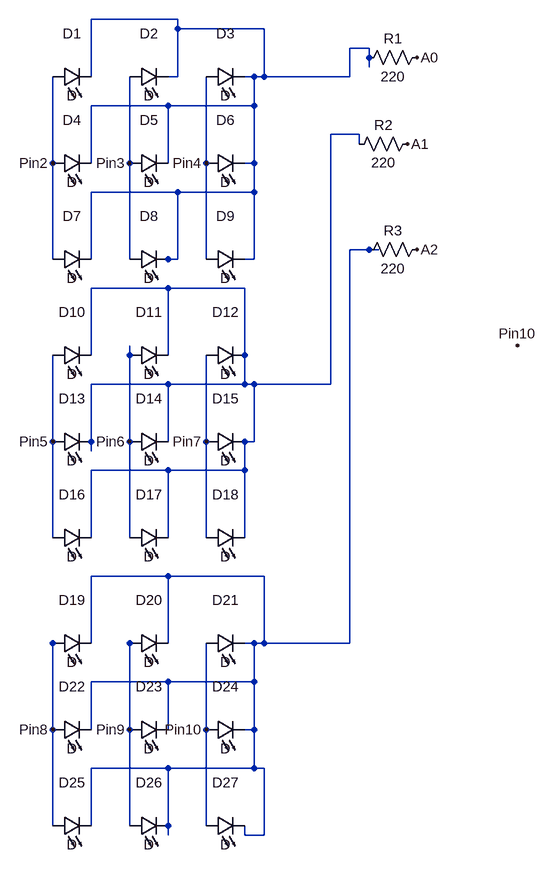
[diagram p0: schematic LightCube.asc]
LightCube.asc, the LTspice schematic file:
Version 4
SHEET 1 880 1344
WIRE -3408 -544 -3552 -544
WIRE -3408 -528 -3408 -544
WIRE -3264 -528 -3408 -528
WIRE -2864 -496 -2896 -496
WIRE -2864 -480 -2864 -496
WIRE -2864 -464 -2864 -480
WIRE -3552 -448 -3552 -544
WIRE -3408 -448 -3408 -528
WIRE -3408 -448 -3424 -448
WIRE -3280 -448 -3296 -448
WIRE -3264 -448 -3264 -528
WIRE -3264 -448 -3280 -448
WIRE -2896 -448 -2896 -496
WIRE -2896 -448 -3264 -448
WIRE -3424 -400 -3552 -400
WIRE -3280 -400 -3280 -448
WIRE -3280 -400 -3424 -400
WIRE -2880 -352 -2928 -352
WIRE -2880 -336 -2880 -352
WIRE -3616 -304 -3616 -448
WIRE -3552 -304 -3552 -400
WIRE -3488 -304 -3488 -448
WIRE -3424 -304 -3424 -400
WIRE -3360 -304 -3360 -448
WIRE -3280 -304 -3280 -400
WIRE -3280 -304 -3296 -304
WIRE -3408 -256 -3552 -256
WIRE -3280 -256 -3280 -304
WIRE -3280 -256 -3408 -256
WIRE -2864 -160 -2896 -160
WIRE -2848 -160 -2864 -160
WIRE -3616 -144 -3616 -304
WIRE -3552 -144 -3552 -256
WIRE -3488 -144 -3488 -304
WIRE -3424 -144 -3440 -144
WIRE -3408 -144 -3408 -256
WIRE -3408 -144 -3424 -144
WIRE -3360 -144 -3360 -304
WIRE -3280 -144 -3280 -256
WIRE -3280 -144 -3296 -144
WIRE -3424 -96 -3552 -96
WIRE -3296 -96 -3424 -96
WIRE -3552 16 -3552 -96
WIRE -3488 16 -3488 0
WIRE -3424 16 -3424 -96
WIRE -3296 16 -3296 -96
WIRE -3424 64 -3552 64
WIRE -3296 64 -3296 16
WIRE -3296 64 -3424 64
WIRE -3280 64 -3296 64
WIRE -2928 64 -2928 -352
WIRE -2928 64 -3280 64
WIRE -3616 160 -3616 16
WIRE -3552 160 -3552 64
WIRE -3488 160 -3488 16
WIRE -3424 160 -3424 64
WIRE -3360 160 -3360 16
WIRE -3280 160 -3280 64
WIRE -3280 160 -3296 160
WIRE -3552 176 -3552 160
WIRE -3424 208 -3552 208
WIRE -3296 208 -3296 160
WIRE -3296 208 -3424 208
WIRE -3616 320 -3616 160
WIRE -3552 320 -3552 208
WIRE -3488 320 -3488 160
WIRE -3424 320 -3424 208
WIRE -3360 320 -3360 160
WIRE -3296 320 -3296 208
WIRE -3424 384 -3552 384
WIRE -3264 384 -3424 384
WIRE -3600 496 -3616 496
WIRE -3552 496 -3552 384
WIRE -3472 496 -3488 496
WIRE -3424 496 -3424 384
WIRE -3280 496 -3296 496
WIRE -3264 496 -3264 384
WIRE -3264 496 -3280 496
WIRE -2896 496 -2896 -160
WIRE -2896 496 -3264 496
WIRE -3424 560 -3552 560
WIRE -3280 560 -3280 496
WIRE -3280 560 -3424 560
WIRE -3616 640 -3616 496
WIRE -3552 640 -3552 560
WIRE -3488 640 -3488 496
WIRE -3424 640 -3424 560
WIRE -3360 640 -3360 496
WIRE -3280 640 -3280 560
WIRE -3280 640 -3296 640
WIRE -3424 704 -3552 704
WIRE -3280 704 -3280 640
WIRE -3280 704 -3424 704
WIRE -3264 704 -3280 704
WIRE -3616 800 -3616 640
WIRE -3552 800 -3552 704
WIRE -3488 800 -3488 640
WIRE -3424 800 -3424 704
WIRE -3360 800 -3360 640
WIRE -3424 816 -3424 800
WIRE -3296 816 -3296 800
WIRE -3264 816 -3264 704
WIRE -3264 816 -3296 816
FLAG -2784 -480 A0
FLAG -2800 -336 A1
FLAG -2784 -160 A2
FLAG -3616 -304 Pin2
FLAG -3488 -304 Pin3
FLAG -3360 -304 Pin4
FLAG -3616 160 Pin5
FLAG -3488 160 Pin6
FLAG -3360 160 Pin7
FLAG -3616 640 Pin8
FLAG -3488 640 Pin9
FLAG -3360 640 Pin10
FLAG 0 0 Pin10
SYMBOL LED -3616 -432 R270
WINDOW 0 72 32 VTop 2
WINDOW 3 0 32 VBottom 2
SYMATTR InstName D1
SYMBOL LED -3488 -432 R270
WINDOW 0 72 32 VTop 2
WINDOW 3 0 32 VBottom 2
SYMATTR InstName D2
SYMBOL LED -3360 -432 R270
WINDOW 0 72 32 VTop 2
WINDOW 3 0 32 VBottom 2
SYMATTR InstName D3
SYMBOL LED -3616 -288 R270
WINDOW 0 72 32 VTop 2
WINDOW 3 0 32 VBottom 2
SYMATTR InstName D4
SYMBOL LED -3488 -288 R270
WINDOW 0 72 32 VTop 2
WINDOW 3 0 32 VBottom 2
SYMATTR InstName D5
SYMBOL LED -3360 -288 R270
WINDOW 0 72 32 VTop 2
WINDOW 3 0 32 VBottom 2
SYMATTR InstName D6
SYMBOL LED -3616 -128 R270
WINDOW 0 72 32 VTop 2
WINDOW 3 0 32 VBottom 2
SYMATTR InstName D7
SYMBOL LED -3488 -128 R270
WINDOW 0 72 32 VTop 2
WINDOW 3 0 32 VBottom 2
SYMATTR InstName D8
SYMBOL LED -3360 -128 R270
WINDOW 0 72 32 VTop 2
WINDOW 3 0 32 VBottom 2
SYMATTR InstName D9
SYMBOL LED -3616 32 R270
WINDOW 0 72 32 VTop 2
WINDOW 3 0 32 VBottom 2
SYMATTR InstName D10
SYMBOL LED -3488 32 R270
WINDOW 0 72 32 VTop 2
WINDOW 3 0 32 VBottom 2
SYMATTR InstName D11
SYMBOL LED -3360 32 R270
WINDOW 0 72 32 VTop 2
WINDOW 3 0 32 VBottom 2
SYMATTR InstName D12
SYMBOL LED -3616 176 R270
WINDOW 0 72 32 VTop 2
WINDOW 3 0 32 VBottom 2
SYMATTR InstName D13
SYMBOL LED -3488 176 R270
WINDOW 0 72 32 VTop 2
WINDOW 3 0 32 VBottom 2
SYMATTR InstName D14
SYMBOL LED -3360 176 R270
WINDOW 0 72 32 VTop 2
WINDOW 3 0 32 VBottom 2
SYMATTR InstName D15
SYMBOL LED -3616 336 R270
WINDOW 0 72 32 VTop 2
WINDOW 3 0 32 VBottom 2
SYMATTR InstName D16
SYMBOL LED -3488 336 R270
WINDOW 0 72 32 VTop 2
WINDOW 3 0 32 VBottom 2
SYMATTR InstName D17
SYMBOL LED -3360 336 R270
WINDOW 0 72 32 VTop 2
WINDOW 3 0 32 VBottom 2
SYMATTR InstName D18
SYMBOL LED -3616 512 R270
WINDOW 0 72 32 VTop 2
WINDOW 3 0 32 VBottom 2
SYMATTR InstName D19
SYMBOL LED -3488 512 R270
WINDOW 0 72 32 VTop 2
WINDOW 3 0 32 VBottom 2
SYMATTR InstName D20
SYMBOL LED -3360 512 R270
WINDOW 0 72 32 VTop 2
WINDOW 3 0 32 VBottom 2
SYMATTR InstName D21
SYMBOL LED -3616 656 R270
WINDOW 0 72 32 VTop 2
WINDOW 3 0 32 VBottom 2
SYMATTR InstName D22
SYMBOL LED -3488 656 R270
WINDOW 0 72 32 VTop 2
WINDOW 3 0 32 VBottom 2
SYMATTR InstName D23
SYMBOL LED -3360 656 R270
WINDOW 0 72 32 VTop 2
WINDOW 3 0 32 VBottom 2
SYMATTR InstName D24
SYMBOL LED -3616 816 R270
WINDOW 0 72 32 VTop 2
WINDOW 3 0 32 VBottom 2
SYMATTR InstName D25
SYMBOL LED -3488 816 R270
WINDOW 0 72 32 VTop 2
WINDOW 3 0 32 VBottom 2
SYMATTR InstName D26
SYMBOL LED -3360 816 R270
WINDOW 0 72 32 VTop 2
WINDOW 3 0 32 VBottom 2
SYMATTR InstName D27
SYMBOL res -2768 -496 R90
WINDOW 0 0 56 VBottom 2
WINDOW 3 32 56 VTop 2
SYMATTR InstName R1
SYMATTR Value 220
SYMBOL res -2784 -352 R90
WINDOW 0 0 56 VBottom 2
WINDOW 3 32 56 VTop 2
SYMATTR InstName R2
SYMATTR Value 220
SYMBOL res -2768 -176 R90
WINDOW 0 0 56 VBottom 2
WINDOW 3 32 56 VTop 2
SYMATTR InstName R3
SYMATTR Value 220

The netlist it stands for:
* LightCube.asc
D1 Pin2 N001 D
D2 Pin3 N001 D
D3 Pin4 N001 D
D4 Pin2 N001 D
D5 Pin3 N001 D
D6 Pin4 N001 D
D7 Pin2 N001 D
D8 Pin3 N001 D
D9 Pin4 N001 D
D10 Pin5 N002 D
D11 Pin6 N002 D
D12 Pin7 N002 D
D13 Pin5 N002 D
D14 Pin6 N002 D
D15 Pin7 N002 D
D16 Pin5 N002 D
D17 Pin6 N002 D
D18 Pin7 N002 D
D19 Pin8 N003 D
D20 Pin9 N003 D
D21 Pin10 N003 D
D22 Pin8 N003 D
D23 Pin9 N003 D
D24 Pin10 N003 D
D25 Pin8 N003 D
D26 Pin9 N003 D
D27 Pin10 N003 D
R1 A0 N001 220
R2 A1 N002 220
R3 A2 N003 220
.model D D
.lib standard.dio
.backanno
.end